# EAGLE design ard_220v_vent (EAGLE 7.1.0)
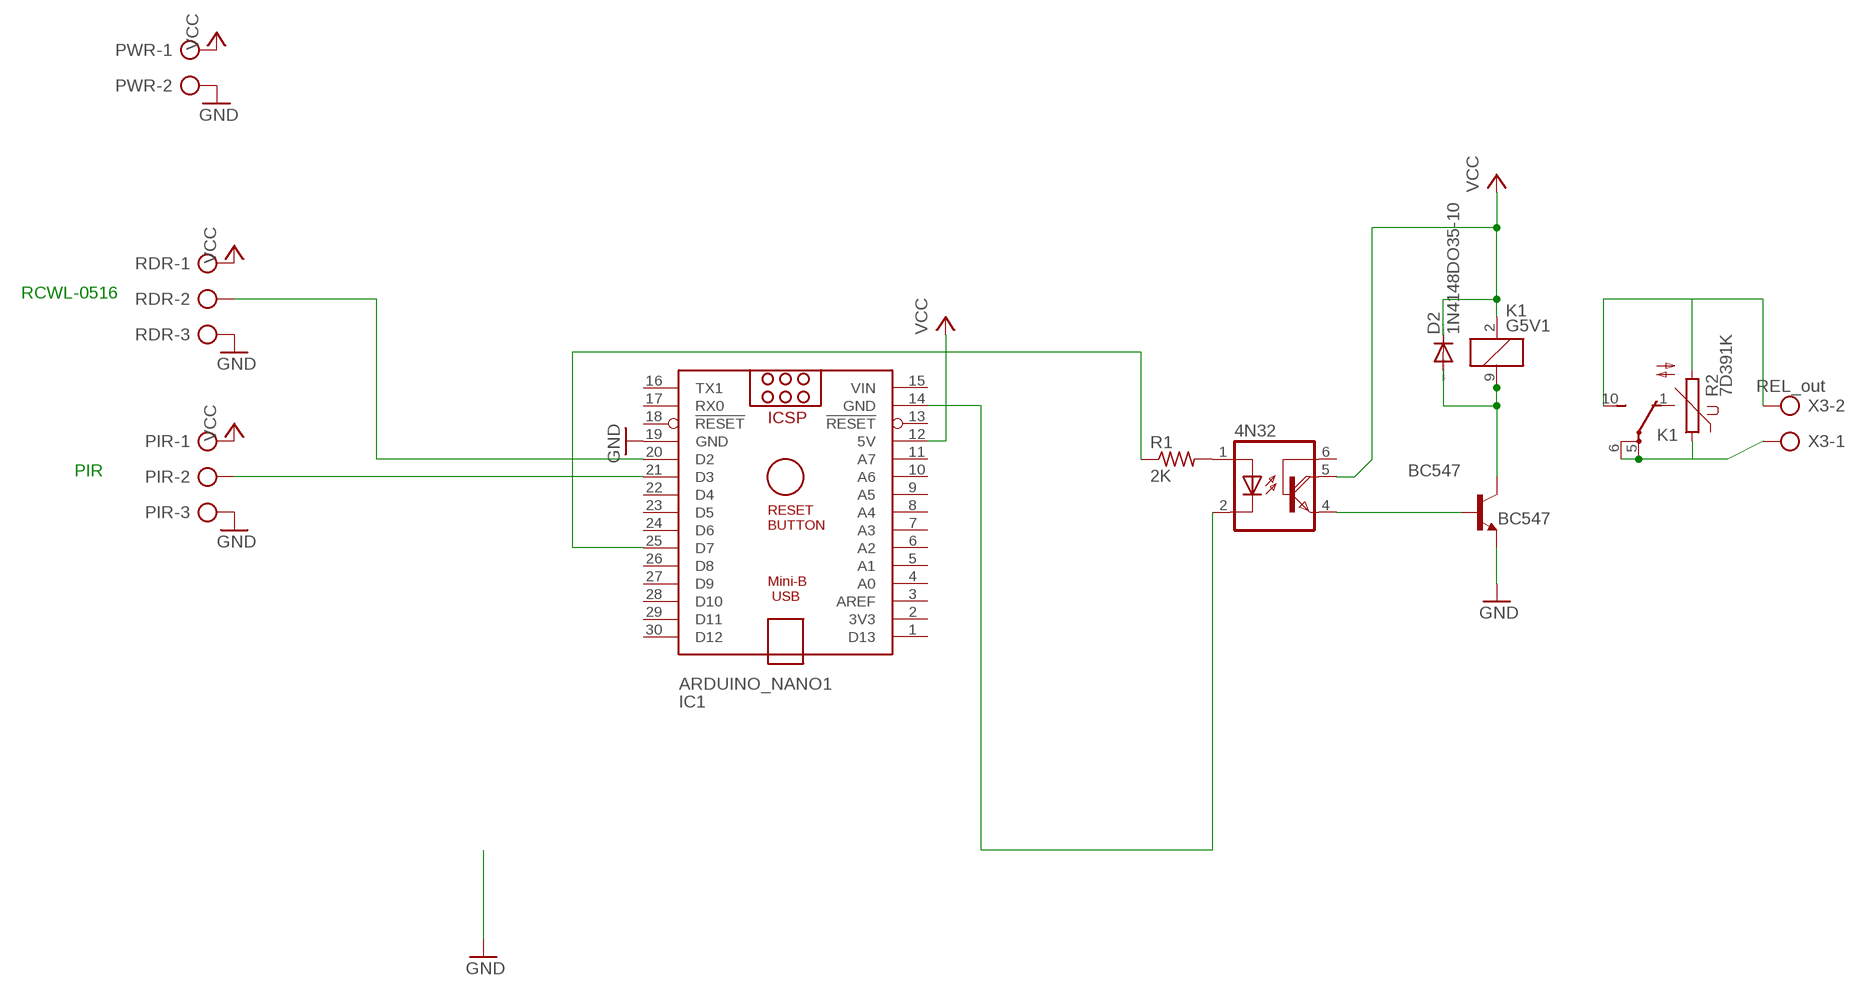
[diagram p0: schematic, sheet 1]

## Parts
4N32  4N33  [DIL06]
ARDUINO_NANO1  IC1  ARDUINO_NANO  [ARDUINO_NANO]
BC547  BC547  [TO92]
D2  1N4148DO35-10  [DO35-10]
K1  G5V1  [G5V1]
PIR  AK500/3  [AK500/3]
PWR  AK500/2  [AK500/2]
R1  2K  R-US_0207/10  [0207/10]
R2  7D391K  S07K385  [S07K385]
RDR  AK500/3  [AK500/3]
X3  REL_out  AK500/2  [AK500/2]

## Nets
GND: ARDUINO_NANO1.19(GND) BC547.1(E) PIR.3 PWR.2 RDR.3
N$1: BC547.3(C) D2.A K1.9
N$2: 4N32.1(A) R1.2
N$3: ARDUINO_NANO1.25(D7) R1.1
N$4: K1.10(2:S) R2.2 X3.2
N$5: 4N32.4(E) BC547.2(B)
N$6: K1.5(2:P) K1.6(2:P) R2.1 X3.1
N$7: ARDUINO_NANO1.21(D3) PIR.2
N$8: ARDUINO_NANO1.20(D2) RDR.2
N$9: 4N32.2(C) ARDUINO_NANO1.14(GND)
VCC: 4N32.5(COL) ARDUINO_NANO1.12(5V) D2.C K1.2 PIR.1 PWR.1 RDR.1
Unconnected: 4N32.6(B) ARDUINO_NANO1.1(D13) ARDUINO_NANO1.2(3V3) ARDUINO_NANO1.3(AREF) ARDUINO_NANO1.4(A0) ARDUINO_NANO1.5(A1) ARDUINO_NANO1.6(A2) ARDUINO_NANO1.7(A3) ARDUINO_NANO1.8(A4) ARDUINO_NANO1.9(A5) ARDUINO_NANO1.10(A6) ARDUINO_NANO1.11(A7) ARDUINO_NANO1.13(!RESET) ARDUINO_NANO1.16(TX1) ARDUINO_NANO1.17(RX0) ARDUINO_NANO1.18(!RESET) ARDUINO_NANO1.22(D4) ARDUINO_NANO1.23(D5) ARDUINO_NANO1.24(D6) ARDUINO_NANO1.26(D8) ARDUINO_NANO1.27(D9) ARDUINO_NANO1.28(D10) ARDUINO_NANO1.29(D11) ARDUINO_NANO1.30(D12) K1.1(2:O)

## Notes on the sheet
- RCWL-0516
- PIR

## Power pins joined to a net without a drawn wire
VIN: ARDUINO_NANO1.15(VIN)

## Library data of the parts
4N32 = optocoupler:4N33: MOTOROLA OPTO COUPLER; MF: VISHAY/TELEFUNKEN; MPN: 4N32; OC_FARNELL: 1469601; OC_NEWARK: 88K1390
ARDUINO_NANO1 = ArduinoNanoV30:ARDUINO_NANO: Arduino Nano V3.0 Overview: The Arduino Nano is a small, complete, and breadboard-friendly board based on the ATmega328 (Arduino Nano 3.x) or ATmega168 (Arduino Nano 2.x). It has more or less the same functionality of the Arduino Duemilanove, but in a different package. It lacks only a DC power jack, and works with a Mini-B USB cable instead of a standard one. The Nano was designed and is being produced by Gravitech. Specifications: Microcontroller Atmel ATmega168 or ATmega328 Operating Voltage (logic level) 5 V Input Voltage (recommended) 7-12 V Input Voltage (limits) 6-20 V Digital I/O Pins 14 (of which 6 provide PWM output) Analog Input Pins 8 DC Current per I/O Pin 40 mA Flash Memory 16 KB (ATmega168) or 32 KB (ATmega328) of which 2 KB used by bootloader SRAM 1 KB (ATmega168) or 2 KB (ATmega328) EEPROM 512 bytes (ATmega168) or 1 KB (ATmega328) Clock Speed 16 MHz Dimensions 0.73" x 1.70" Length 45 mm Width 18 mm Weigth 5 g Power: The Arduino Nano can be powered via the Mini-B USB connection, 6-20V unregulated external power supply (pin 30), or 5V regulated external power supply (pin 27). The power source is automatically selected to the highest voltage source. Memory: The ATmega168 has 16 KB of flash memory for storing code (of which 2 KB is used for the bootloader); the ATmega328 has 32 KB, (also with 2 KB used for the bootloader). The ATmega168 has 1 KB of SRAM and 512 bytes of EEPROM (which can be read and written with the EEPROM library); the ATmega328 has 2 KB of SRAM and 1 KB of EEPROM. Input and Output: Each of the 14 digital pins on the Nano can be used as an input or output, using pinMode(), digitalWrite(), and digitalRead() functions. They operate at 5 volts. Each pin can provide or receive a maximum of 40 mA and has an internal pull-up resistor (disconnected by default) of 20-50 kOhms. In addition, some pins have specialized functions. Visit Arduino - ArduinoBoardNano <https://www.arduino.cc/en/Main/ArduinoBoardNano>
BC547 = transistor:BC547: NPN TRANSISTOR
D2 = diode:1N4148: DIODE high speed (Philips)
K1 = relay:G5V1: RELAY 1 x switch, 0.5 A/125 V AC, 1 A/24 V DC , Omron; MPN: G5V-1-DC24; OC_FARNELL: 9949593; OC_NEWARK: 36M6377
PIR RDR = con-ptr500:AK500/3: CONNECTOR; OC_FARNELL: unknown; OC_NEWARK: unknown
PWR X3 = con-ptr500:AK500/2: CONNECTOR; OC_FARNELL: unknown; OC_NEWARK: unknown
R1 = resistor:R-US_: RESISTOR, American symbol
R2 = varistor:S07K385: VARISTOR

## Board
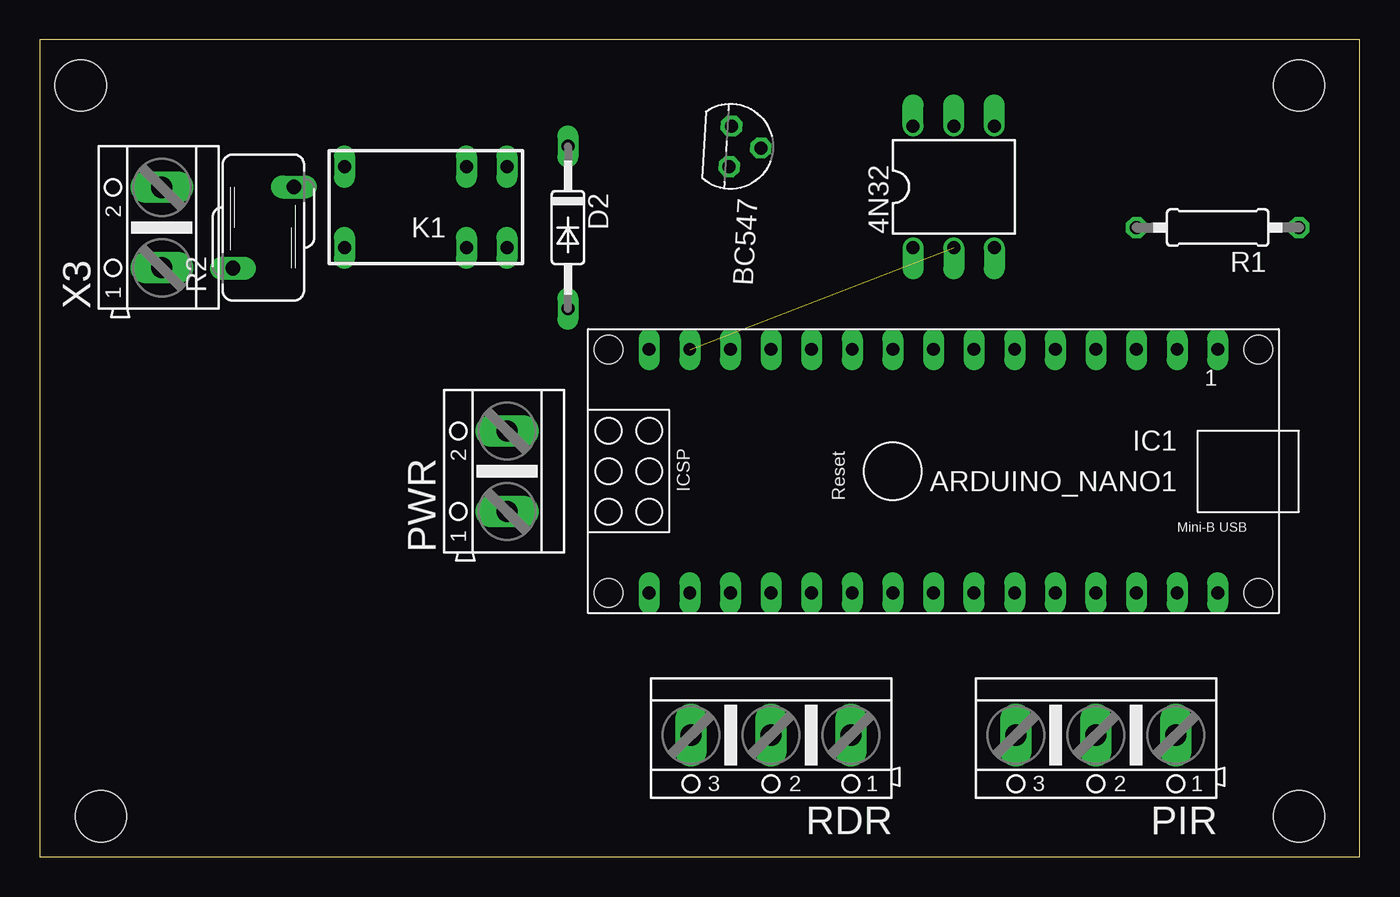
[diagram p1: board, top side]
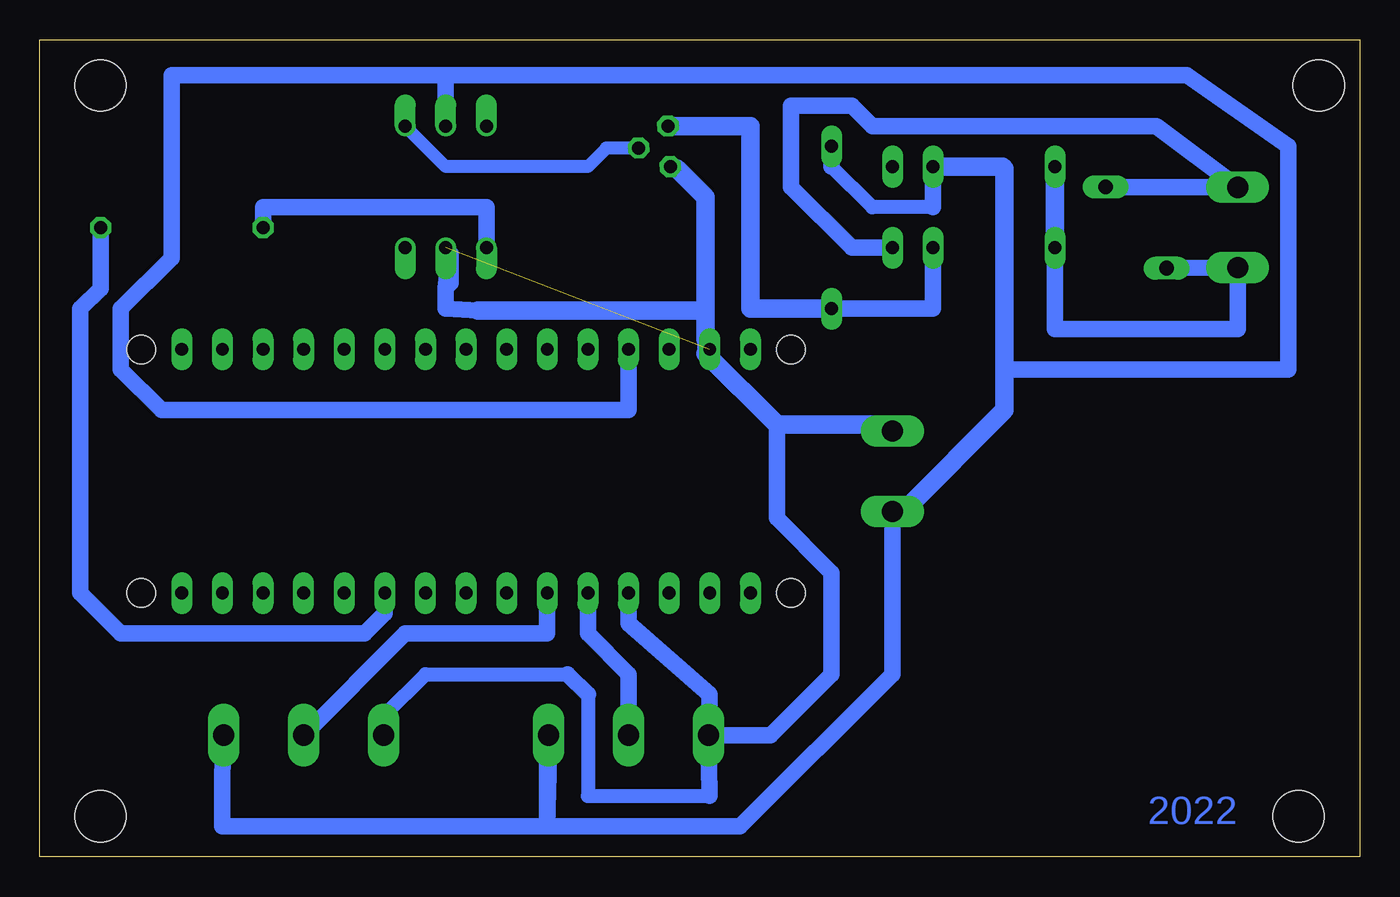
[diagram p2: board, bottom side, seen from below]

Size 82.53 x 51.11 mm. Coordinates in mm from the lower left corner, seen from the top.
Outline: 0,0 82.53,0 82.53,51.11 0,51.11 0,0
Copper layers (1*16): Top 0.035mm / dielectric 1.5mm / Bottom 0.035mm
Design rules "default *": minimum track width 40mil, minimum drill 24mil, track to track 25mil, track to pad 25mil, pad to pad 25mil, via to via 25mil, smd to smd 8mil, copper to edge 40mil, drill to drill 8mil, minimum pad ring 10mil, minimum via ring 8mil, stop-mask expansion 4mil, vias tented up to drill 0mil, thermal gap 10mil
Holes 3.2 mm at 3.81,2.54 78.74,2.54 78.74,48.26 2.54,48.26

### Footprints (pad centres in the part's own frame; a part is rotated, then mirrored left to right if it is on the bottom)
DIL06 = drill 0.813 offset: 1 -2.54,-3.81; 2 0,-3.81; 3 2.54,-3.81; 4 2.54,3.81; 5 0,3.81; 6 -2.54,3.81
ARDUINO_NANO = drill 0.8 long: 1 -20.32,-7.62; 2 -17.78,-7.62; 3 -15.24,-7.62; 4 -12.7,-7.62; 5 -10.16,-7.62; 6 -7.62,-7.62; 7 -5.08,-7.62; 8 -2.54,-7.62; 9 0,-7.62; 10 2.54,-7.62; 11 5.08,-7.62; 12 7.62,-7.62; 13 10.16,-7.62; 14 12.7,-7.62; 15 15.24,-7.62; 16 15.24,7.62; 17 12.7,7.62; 18 10.16,7.62; 19 7.62,7.62; 20 5.08,7.62; 21 2.54,7.62; 22 0,7.62; 23 -2.54,7.62; 24 -5.08,7.62; 25 -7.62,7.62; 26 -10.16,7.62; 27 -12.7,7.62; 28 -15.24,7.62; 29 -17.78,7.62; 30 -20.32,7.62 | hole 1.778: -22.86,-7.62; -22.86,7.62; 17.78,7.62; 17.78,-7.62
TO92 = drill 0.813 octagon: 1 1.27,0; 2 0,1.905; 3 -1.27,0
DO35-10 = drill 0.813 long: A 5.08,0; C -5.08,0
G5V1 = drill 0.813 long: 1 -5.08,-2.54; 2 -2.54,-2.54; 5 5.08,-2.54; 6 5.08,2.54; 9 -2.54,2.54; 10 -5.08,2.54
AK500/3 = drill 1.321 long: 1 -5.004,0; 2 0,0; 3 5.004,0
AK500/2 = drill 1.321 long: 1 -2.515,0; 2 2.515,0
0207/10 = drill 0.813 octagon: 1 -5.08,0; 2 5.08,0
S07K385 = drill 0.914 long: 1 -1.905,-2.54; 2 1.905,2.54

### Placement (x,y rotation side)
4N32  57.15,41.91 0 top
ARDUINO_NANO1  53.34,24.13 180 top
BC547  43.18,44.45 266.8 top
D2  33.02,39.37 270 top
K1  24.13,40.64 180 top
PIR  66.04,7.62 180 top
PWR  29.21,24.13 90 top
R1  73.66,39.37 180 top
R2  13.97,39.37 0 top
RDR  45.72,7.62 180 top
X3  7.62,39.37 90 top

### Tracks (layer width: path | path; a pad name or v marks a point on that pad's centre or on a via)
GND
  Bottom 0.889: 60.96,8.89 58.42,11.43 49.53,11.43 | 48.26,10.16 48.26,3.81 40.64,3.81
  Bottom 1.016: PIR.3 60.96,8.89 | 49.53,11.43 48.26,10.16 | 40.64,3.81 RDR.3 | 36.45,27.05 36.45,21.21 33.02,17.78 33.02,11.43 36.83,7.62 RDR.3 | RDR.3 40.64,7.7 40.64,10.16 45.72,14.61 ARDUINO_NANO1.19 | 55.12,34.16 57.15,34.29 57.15,35.56 56.9,37.72 | 40.89,32.38 40.89,31.5
  Bottom 1.143: 40.89,34.16 40.89,41.28 42.67,43.05 BC547.1 | 40.89,34.16 40.89,32.38 | 56.9,35.94 56.9,37.72 | 40.89,34.16 55.12,34.16 | 40.89,31.5 36.45,27.05 29.34,27.05 PWR.2
N$1
  Bottom 1.016: D2.A 26.67,34.29 K1.9
  Bottom 1.143: D2.A 38.1,34.29 38.1,45.72 42.67,45.72 BC547.3
N$2
  Bottom 1.016: 4N32.1 54.61,40.64 68.58,40.64 R1.2
N$3
  Bottom 1.016: ARDUINO_NANO1.25 60.96,15.24 62.23,13.97 77.47,13.97 80.01,16.51 80.01,34.29 78.74,35.56 R1.1
N$4
  Bottom 1.016: K1.10 31.75,38.1 35.56,41.91 35.56,46.99 31.75,46.99 30.48,45.72 12.7,45.72 X3.2 R2.2
N$5
  Bottom 0.813: BC547.2 47.1,44.34 48.26,43.18 57.15,43.18 4N32.4
N$6
  Bottom 1.016: R2.1 X3.1 7.62,33.02 19.05,33.02 K1.6
  Bottom 1.143: K1.5 K1.6
N$7
  Bottom 1.016: ARDUINO_NANO1.21 50.8,13.97 59.69,13.97 PIR.2
N$8
  Bottom 1.016: ARDUINO_NANO1.20 48.26,13.97 45.72,11.43 RDR.2
N$9  (1 unrouted)
VCC
  Bottom 0.889: 26.67,40.64 30.48,40.64 33.02,43.18
  Bottom 1.016: 50.8,1.91 50.8,6.35 RDR.1 50.72,5.16 50.8,1.91 | 50.8,1.91 71.12,1.91 71.12,5.08 PIR.1 | 29.23,21.59 PWR.1 29.21,11.43 38.73,1.91 50.8,1.91 | 4N32.5 57.15,48.9 | 57.15,48.9 10.79,48.9 4.45,44.45 4.45,30.48 22.23,30.48 | ARDUINO_NANO1.12 45.72,27.94 74.93,27.94 77.47,30.48 77.47,34.29 74.3,37.47 74.3,48.9 57.15,48.9 | K1.2 26.67,40.64 | 33.02,43.18 D2.C
  Bottom 1.143: PWR.1 28.45,21.72 22.23,27.94 22.23,30.48 22.23,43.05 22.35,43.18 K1.2

### Text on the board
Bottom: 2022